# Altium project B215_ANNA-B1_Edge_carrier_small.PrjPcb
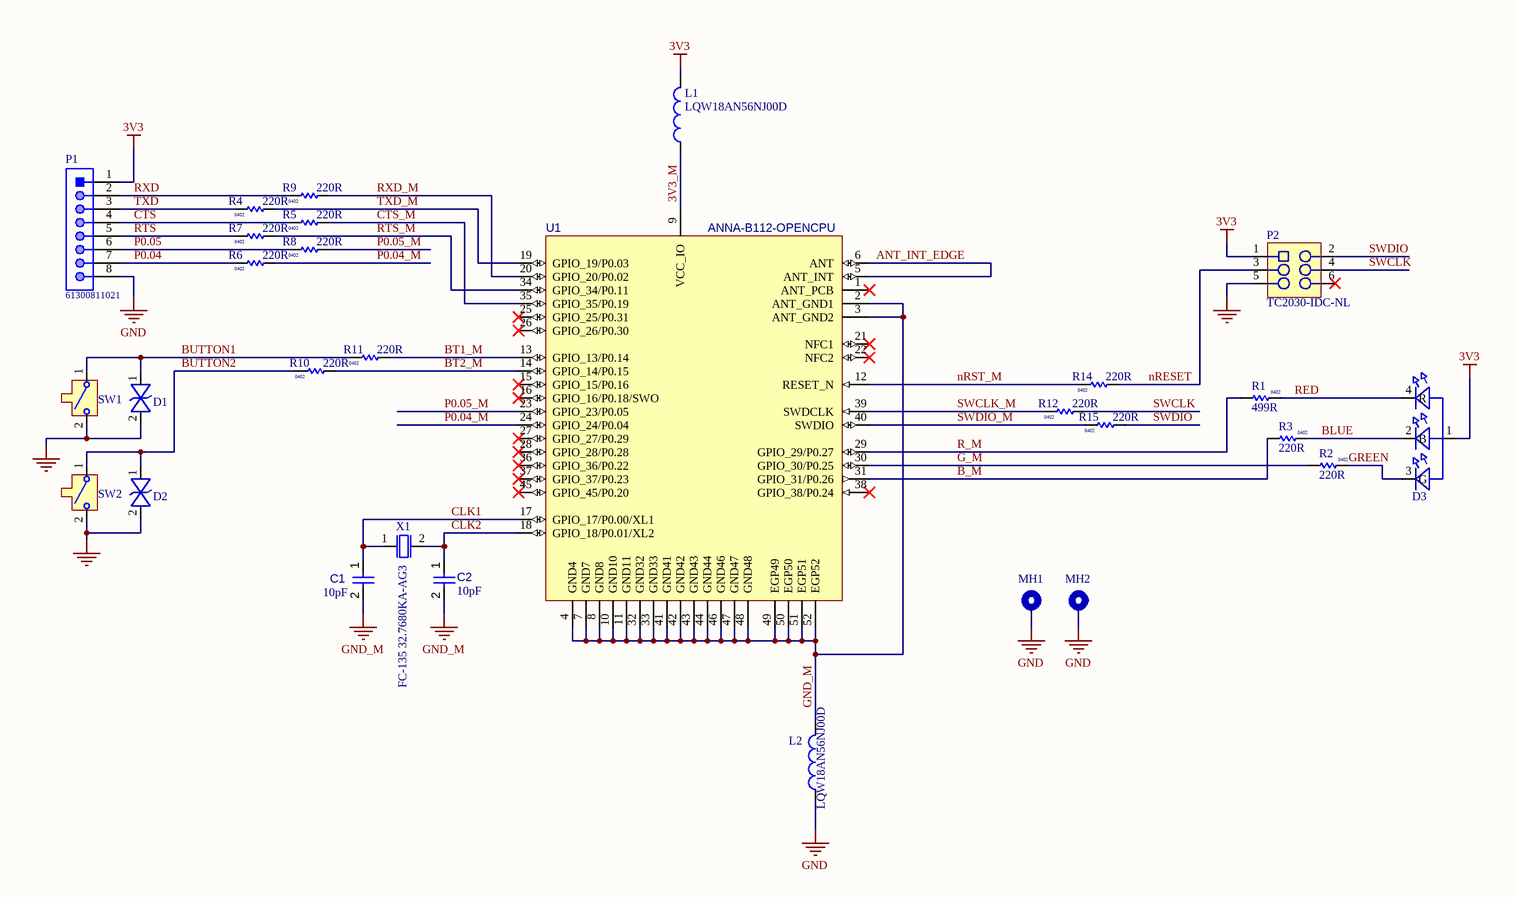
[diagram p0: B215.SchDoc]
GlobalClientName: u-blox; GlobalProjectLink: www.u-blox.com; GlobalProjectName: TE_SUP_ANT; GlobalProjectRevision: B; GlobalProjectTeam: u-blox AG; GlobalReleaseDate: 2020-10-23; PCBDocNum: B215; PCBName: B215 ANNA-B1 Edge CS; ProjectEngineer: LKIS; ReleaseBy1: LKIS; ReleaseBy2: BREC; ReleaseBy3: -; ReleaseDate1: 2020-10-23; ReleaseDate2: 2021-09-02; ReleaseDate3: -; ReleaseDesc1: Initial Release; ReleaseDesc2: Corrected RTS/CTS; ReleaseDesc3: -; ReleaseRev1: A; ReleaseRev2: B; ReleaseRev3: -; SchDocNum: B215; SchSheetTotal: 1
1 sheet, 31 parts. Net scope: global (net labels, ports and power ports of the same name join across sheets).
Board file: B215.PcbDoc

## Sheet B215.SchDoc: Sheet Name
size B; Website: www.rigado.com; SheetTitle: Sheet Title; DrawnBy: Your Name; SheetNumber: 1; SheetTotal: X; SheetSize: B

### Parts
(Parts that share a designator on the sheet are numbered #1, #2 ... from top to bottom, then left to right.)
?#1  (no value)  (graphical)
?#2  (no value)  (graphical)
C1  value 10pF  [CAPC1005X55X25ML05T05]  (hidden comment: Capacitor 10 pF +/- 5% 50 V 0402)
C2  value 10pF  [CAPC1005X55X25ML05T05]  (hidden comment: Capacitor 10 pF +/- 5% 50 V 0402)
D1  (no value)  [SOD-923]
D2  (no value)  [SOD-923]
D3  (no value)  [4-PLCC]
L1  LQW18AN56NJ00D  [INDC1608X100X30LL20T10]
L2  LQW18AN56NJ00D  [INDC1608X100X30LL20T10]
MH1  MH_M1.5DNP  [MH_M1.5]  (value not drawn)
MH2  MH_M1.5DNP  [MH_M1.5]  (value not drawn)
P1  61300811021  [61300811021]
P2  TC2030-IDC-NLDNP  [TC2030-IDC-NL]  (value not drawn)
R1  value 499R  Size: 0402  [RES 0402 HD]
R2  value 220R  Size: 0402  [RES 0402 HD]
R3  value 220R  Size: 0402  [RES 0402 HD]
R4  value 220R  Size: 0402  [RES 0402 HD]
R5  value 220R  Size: 0402  [RES 0402 HD]
R6  value 220R  Size: 0402  [RES 0402 HD]
R7  value 220R  Size: 0402  [RES 0402 HD]
R8  value 220R  Size: 0402  [RES 0402 HD]
R9  value 220R  Size: 0402  [RES 0402 HD]
R10  value 220R  Size: 0402  [RES 0402 HD]
R11  value 220R  Size: 0402  [RES 0402 HD]
R12  value 220R  Size: 0402  [RES 0402 HD]
R14  value 220R  Size: 0402  [RES 0402 HD]
R15  value 220R  Size: 0402  [RES 0402 HD]
SW1  (no value)  [B3U-1000P]
SW2  (no value)  [B3U-1000P]
U1  ANNA-B112-OPENCPU  [ANNA_LGA52S_650X650]
X1  Manufacturer P/N: FC-135 32.7680KA-AG3  [XTAL_3215]

### Nets
3V3: D3.1(A) L1.2 P1.1 P2.1
GND: D1.2 D2.2 L2.1 MH1.1 MH2.1 P1.8 P2.5 SW1.2 SW2.2
GND_M: C1.2 C2.2 L2.2 U1.2(ANT_GND1) U1.3(ANT_GND2) U1.4(GND4) U1.7(GND7) U1.8(GND8) U1.10(GND10) U1.11(GND11) U1.32(GND32) U1.33(GND33) U1.41(GND41) U1.42(GND42) U1.43(GND43) U1.44(GND44) U1.46(GND46) U1.47(GND47) U1.48(GND48) U1.49(EGP49) U1.50(EGP50) U1.51(EGP51) U1.52(EGP52)
3V3_M: L1.1 U1.9(VCC_IO)
ANT_INT_EDGE: U1.5(ANT_INT) U1.6(ANT)
B_M: R3.1 U1.31(GPIO_31/P0.26)
BLUE: D3.2(B) R3.2
BT1_M: R11.1 U1.13(GPIO_13/P0.14)
BT2_M: R10.1 U1.14(GPIO_14/P0.15)
BUTTON1: D1.1 R11.2 SW1.1
BUTTON2: D2.1 R10.2 SW2.1
CLK1: C1.1 U1.17(GPIO_17/P0.00/XL1) X1.1
CLK2: C2.1 U1.18(GPIO_18/P0.01/XL2) X1.2
CTS: P1.4 R5.2
CTS_M: R5.1 U1.35(GPIO_35/P0.19)
G_M: R2.1 U1.30(GPIO_30/P0.25)
GREEN: D3.3(G) R2.2
nRESET: P2.3 R14.1
nRST_M: R14.2 U1.12(RESET_N)
P0.04: P1.7 R6.2
P0.04_M: R6.1 U1.24(GPIO_24/P0.04)
P0.05: P1.6 R8.2
P0.05_M: R8.1 U1.23(GPIO_23/P0.05)
R_M: R1.1 U1.29(GPIO_29/P0.27)
RED: D3.4(R) R1.2
RTS: P1.5 R7.2
RTS_M: R7.1 U1.34(GPIO_34/P0.11)
RXD: P1.2 R9.2
RXD_M: R9.1 U1.20(GPIO_20/P0.02)
SWCLK: P2.4 R12.1
SWCLK_M: R12.2 U1.39(SWDCLK)
SWDIO: P2.2 R15.1
SWDIO_M: R15.2 U1.40(SWDIO)
TXD: P1.3 R4.2
TXD_M: R4.1 U1.19(GPIO_19/P0.03)

Not connected (* = marked no-connect by the designer): P2 6*; U1 1(ANT_PCB)* 15(GPIO_15/P0.16)* 16(GPIO_16/P0.18/SWO)* 21(NFC1)* 22(NFC2)* 25(GPIO_25/P0.31)* 26(GPIO_26/P0.30)* 27(GPIO_27/P0.29)* 28(GPIO_28/P0.28)* 36(GPIO_36/P0.22)* 37(GPIO_37/P0.23)* 38(GPIO_38/P0.24)* 45(GPIO_45/P0.20)*

### Notes on the sheet
- Rev.
- Description
- Revision
- Date
- By
- Prepared By
- Revision:
- CONFIDENTIAL
- Page:

### Library data of the parts
?#1 = Top_Revision_Block: Release Revision History Block
?#2 = Top_Title_Block: Top level schematic title block for top level sheet
C1 C2 = CMP-001-00013-4: Chip Capacitor, 10 pF, +/- 5%, 50 V, 0402 (1005 Metric); Capacitor Type: Ceramic; Voltage Rating: 50V; Tolerance: 5%; Min Operating Temperature: -55°C; Case/Package: 0402; Max Operating Temperature: 125°C; Mounting Technology: SM; RoHS Compliant: True; Pins: 2
D1 D2 = 110-00019: Diode, ESD9B, 3.3V, ST5G, SOD-923; Part Name: Diode TVS 3.3V SOD-923; Manufacturer: ON Semiconductor; Manufacturer P/N: ESD9B3.3ST5G; Item_Phase: Production; Body Size: 0.8mm x 0.6mm; Component Mounting Type: SMT; Diode Type: TVS; Use in new designs: Yes; Part Number: 110-00019; Part_Type: Diode; Revision: 0A; Supplier 1: Arrow; Supplier Part Number 1: ESD9B3.3ST5G; Arena Link: https://app.bom.com/a/4M5DJQ9Q9SR7DV4H?v=spec.summary; Height: 0.4mm; MFG Package: SOD-923; Package Type: SOD; Pins: 2; Voltage: 3.3V
D3 = 115-00011: LED, RGB Diffused SMT, PLCC4 4 Pin; Part Name: LED RGB SMT 2mm x 2mm; Manufacturer: Cree, Inc.; Manufacturer P/N: CLMVB-FKA-CFHEHLCBB7a363; Item_Phase: Production; Body Size: 2.0mm x 2.0mm; Current: 20mA Red, 10mA Green, 10mA, Blue; Number of Circuits: 3; Use in new designs: Yes; Vf: 2V Red, 3V Green, 3V Blue; Voltage: 5V; Part Number: 115-00011; Part_Type: LED; Revision: 0A; Supplier 1: Mouser; Supplier Part Number 1: 941-CLMVBFKACFHEHLCB; Arena Link: https://app.bom.com/a/UCV39GZGZIHY581D?v=spec.summary; Color: RGB; Component Mounting Type: SMT; Height: 1mm; MFG Package: PLCC4; Mounting Type: Vertical; Package Type: Custom; Pins: 4
L1 L2 = CMP-2000-06600-1: Chip Inductor, 56 nH, +/-5%, 390 mA, -55 to 125 degC, 0603 (1608 Metric), RoHS, Tape and Reel; Manufacturer: Murata; Frequency - Self Resonant: 2.4GHz; DC Resistance (DCR): 290mOhmMax; Online Catalog: LQWSeries; Frequency - Test: 100MHz; Material - Core: Non-Magnetic; Q @ Freq: 38@200MHz; Tolerance: ±5%; Shielding: Unshielded; Current Rating: 360mA; Type: Wirewound; Inductance: 56nH; Other Names: 490-6876-1; Product Training Modules: InductorProductsChipRFInductors; Category: Inductors,Coils,Chokes; Package Reference: 0603; Package Description: 2-Pin Surface Mount Device, Body 1.6 x 0.8 mm; Packaging: CutTape(CT); Series: LQW18A_00; Mounting Type: SurfaceMount; Datasheet Version: 1/2019; Size / Dimension: 0.063"Lx0.031"W(1.60mmx0.80mm); Manufacturer URL: http://www.murata.com/; Mounting Technology: SurfaceMount; Family: FixedInductors; Operating Temperature: -55°C~125°C; Height - Seated (Max): 0.039"(1.00mm); Package / Case: 0603(1608Metric); Standard Package: 1; Datasheet URL: http://search.murata.co.jp/Ceramy/image/img/PDF/ENG/L0075S0080LQW18A_10.pdf
MH1 MH2 = MH_M1.5: 1.5M screw mounting hole, plated; Added By: Jeremy D; Part Number: MH_M1.5; Size: 3.4mm x 3.4mm; Height: 0mm; Type: Mounting Hole; DNP: DNP; Added Date: 2015-07-09
P1 = CMP-1502-01075-1: THT Angled Pin Header WR-PHD, Pitch 2.54 mm, Single Row, 8 pins; Manufacturer: Wurth Elektronik; Manufacturer: Wurth Electronics; Pin Number: 8; Rated Current: 3A; Working Voltage: 250VAC; Withstanding Voltage: 500VAC; Gender: Male; Contact Resistance: 20mOhm; Pitch: 2.54mm; Part Number: 61300811021; Publisher: WurthElektronik; Manufacturer URL: http://www.we-online.de; Row Number: Single; Datasheet URL: https://katalog.we-online.de/em/datasheet/6130xx11021.pdf; Orientation: Angled; Operating Temperature: -40to105degC; Mounting Technology: THT; Package Reference: 61300811021; Packaging: Bag; Manufacturer Part Number: 61300811021
P2 = TC2030-IDC-NL: CON PADS FOR CBL PLUG-OF-NAILS 6-PIN NO LEGS; Manufacturer: TAG Connect; Added By: Paul B; Manufacturer P/N: TC2030-IDC-NL; Part Number: TC2030-IDC-NL; Size: 6.731mm x 12.446mm; Height: 0; DNP: DNP; Added Date: 2015-04-22
R1 = 180-00031: Resistor, 499ohm, 1%, 1/16W, 0402; Part Name: RES SMD 499 OHM 1% 1/16W 0402; Manufacturer: Rohm Semiconductor; Manufacturer P/N: MCR01MRTF4990; Item_Phase: Production; Component Mounting Type: SMT; Tolerance: +/- 1%; Use in new designs: Yes; Part Number: 180-00031; Part_Type: Resistor; Supplier 1: Digi-Key; Supplier Part Number 1: RHM499CDCT-ND; Manufacturer 2: Samsung Electro-Mechanics America, Inc; Manufacturer P/N 2: RC1005F4990CS; Arena Link: https://app.bom.com/a/Q8RZ5CVCVEDU1SS5?v=spec.summary; Height: 0.4mm; Pins: 2; Power: 1/16W; Revision: 0D; Supplier 2: Digi-Key; Supplier Part Number 2: 1276-3992-1-ND; Alternate Footprint Ref: RES 0402
R2 R3 = 180-00098: Resistor, 220ohm, 5%, 1/16W, 0402.; Part Name: RES SMD 220 OHM 5% 1/16W 0402; Manufacturer: Panasonic Electronic Components; Manufacturer P/N: ERJ-2GEJ221X; Item_Phase: Production; Component Mounting Type: SMT; Tolerance: +/- 5%; Use in new designs: Yes; Part Number: 180-00098; Part_Type: Resistor; Supplier 1: Digi-Key; Supplier Part Number 1: P220JCT-ND; Arena Link: https://app.bom.com/a/8Q9HNUDUDWVBJC30?v=spec.summary; Pins: 2; Power: 1/16W; Revision: 0C; Manufacturer 2: Samsung Electro-Mechanics America, Inc; Manufacturer P/N 2: RC1005J221CS; Supplier 2: Digi-Key; Supplier Part Number 2: 1276-4360-1-ND; Alternate Footprint Ref: RES 0402; Height: 0.4mm
R4-R12 R14 R15 = 180-00098: Resistor, 220ohm, 5%, 1/16W, 0402.; Manufacturer 1: Samsung Electro-Mechanics America, Inc; Manufacturer Part Number 1: RC1005J221CS; Part Name: RES SMD 220 OHM 5% 1/16W 0402; Tolerance: +/- 5%; Item Phase: In Production; Use in new designs: Yes; Voltage: None; Part Number: 180-00098; Min Operating Temp: -55; Max Operating Temp: 155; Manufacturer 2: Panasonic Electronic Components; Supplier 1: Digi-Key; Supplier Part Number 1: 1276-4360-1-ND; Manufacturer Part Number 2: ERJ-2GEJ221X; Supplier 2: Digi-Key; Supplier Part Number 2: P220JCT-ND; Height: 0.4mm; Pins: 2; Power: 1/16W; Revision: 0C; UBX Code: None
SW1 SW2 = 135-00007: Button, Momentary SPST-NO, 0.05A, 12V, 3mm x 2.5mm; Part Name: SWITCH TACTILE SPST-NO 0.05A 12V; Manufacturer: Omron Electronics Inc-EMC Div; Item_Phase: Production; Component Mounting Type: SMT; Current: 50mA; Switch/Button Circuit: SPST; Switch/Button Function: Off-Mom; Use in new designs: Yes; Voltage: 12VDC; Part Number: 135-00007; Part_Type: Button; Revision: 0A; Manufacturer P/N: B3U-1000P; Supplier 1: Digi-Key; Supplier Part Number 1: SW1020CT-ND; Arena Link: https://app.bom.com/a/TBU28FYFYHGV5FQ0?v=spec.summary; Body Size: 3mm x 2.5mm; Height: 1.2mm; Pins: 2
U1 = ANNA-B112-OPENCPU: u-blox ANNA-B112 Bluetooth 5 LE module; Part Description: Stand-alone Bluetooth low energy module; Manufacturer: u-blox; Value: ANNA-B112-OPENCPU
X1 = 100-00005: XTAL, 2Pin, 32.768kHz, 7pF 20ppm; Part Name: XTAL 32.768kHz 7pF 20ppm 3215; Part_Type: Crystal/Oscillator; Manufacturer: Epson; Item_Phase: Production; Body Size: 3.2mm x 1.5mm; Component Mounting Type: SMT; MFG Package: 2-SMD; Use in new designs: Yes; Part Number: 100-00005; Revision: 0C; Supplier 1: Digi-Key; Supplier Part Number 1: SER4086CT-ND; Manufacturer 2: AVX Corporation; Manufacturer P/N 2: ST3215SB32768C0HPWBB; Supplier 2: Digi-Key; Supplier Part Number 2: 1253-1113-1-ND; Arena Link: https://app.bom.com/a/L3MU07Q7Q98O5PC8?v=spec.summary; CL: 7pF; Frequency: 32.768kHz; Frequency Tolerance: 20ppm; Height: 0.9mm; Pins: 2

## Assembly variants
B215_ANNA-B1_Edge_carrier_small: not fitted MH1 MH2 P2